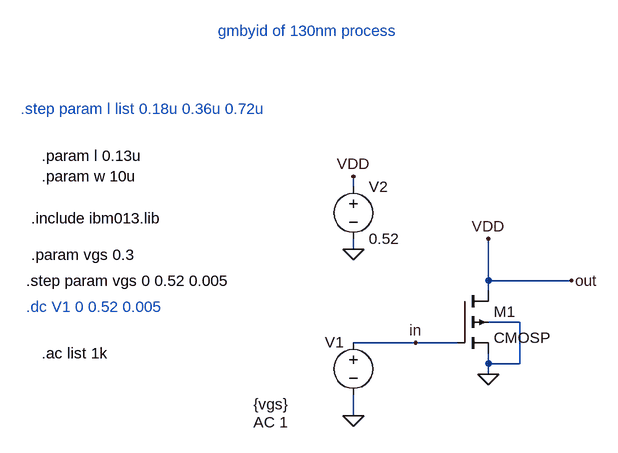
[diagram p0: schematic gmbyid 180nm process.asc]
gmbyid 180nm process.asc, the LTspice schematic file:
Version 4
SHEET 1 948 680
WIRE 0 -48 0 -64
WIRE 0 48 0 32
WIRE 208 96 208 32
WIRE 336 96 208 96
WIRE 208 112 208 96
WIRE 256 160 208 160
WIRE 96 192 0 192
WIRE 160 192 96 192
WIRE 208 224 208 208
WIRE 256 224 256 160
WIRE 256 224 208 224
WIRE 208 240 208 224
WIRE 0 304 0 272
FLAG 208 240 0
FLAG 0 304 0
FLAG 0 48 0
FLAG 336 96 out
FLAG 96 192 in
FLAG 208 32 VDD
FLAG 0 -64 VDD
SYMBOL voltage 0 176 R0
WINDOW 0 -44 15 Left 2
WINDOW 3 -154 110 Left 2
WINDOW 123 -154 138 Left 2
WINDOW 39 0 0 Left 0
SYMATTR InstName V1
SYMATTR Value {vgs}
SYMATTR Value2 AC 1
SYMBOL voltage 0 -64 R0
WINDOW 123 0 0 Left 0
WINDOW 39 0 0 Left 0
SYMATTR InstName V2
SYMATTR Value 0.52
SYMBOL cmosp 160 112 R0
SYMATTR InstName M1
SYMATTR Value2 l={l} w={w} ad={2*0.18u*w} as={2*0.18u*w} pd={2*w+4*0.18u} ps={2*w+4*0.18u}
TEXT -496 0 Left 2 !.include ibm013.lib
TEXT -504 136 Left 2 ;.dc V1 0 0.52 0.005
TEXT -208 -288 Left 2 ;gmbyid of 130nm process
TEXT -504 96 Left 2 !.step param vgs 0 0.52 0.005
TEXT -480 208 Left 2 !.ac list 1k
TEXT -480 -96 Left 2 !.param l 0.13u\n.param w 10u
TEXT -512 -168 Left 2 ;.step param l list 0.18u 0.36u 0.72u
TEXT -496 56 Left 2 !.param vgs 0.3

The netlist it stands for:
* gmbyid 180nm process.asc
V1 in 0 {vgs} AC 1
V2 VDD 0 0.52
M1 VDD in 0 0 CMOSP l={l} w={w} ad={2*0.18u*w} as={2*0.18u*w} pd={2*w+4*0.18u} ps={2*w+4*0.18u}
.model NMOS NMOS
.model PMOS PMOS
.lib standard.mos
.include ibm013.lib
* .dc V1 0 0.52 0.005
* gmbyid of 130nm process
.step param vgs 0 0.52 0.005
.ac list 1k
.param l 0.13u
.param w 10u
* .step param l list 0.18u 0.36u 0.72u
.param vgs 0.3
.backanno
.end